# Altium schematic sheet GPS.SchDoc
size A4; SheetNumber: 2; SheetTotal: 5
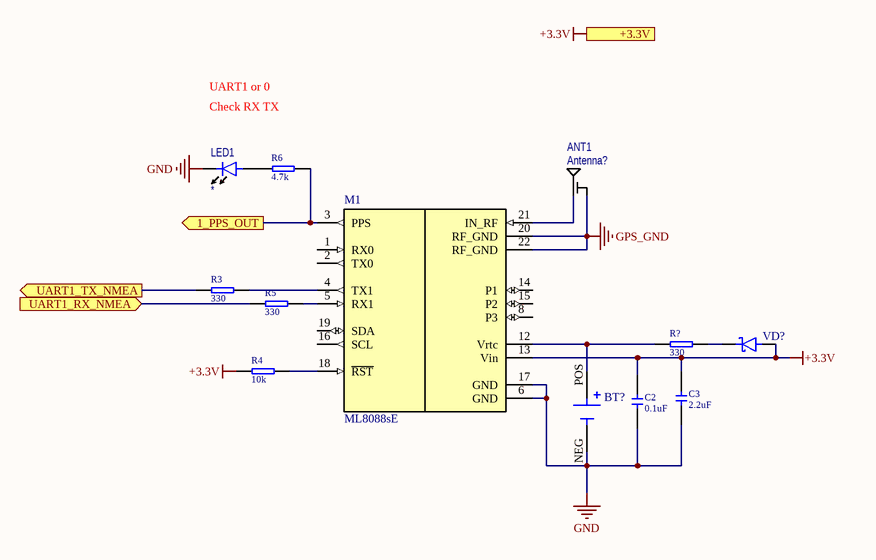
[diagram p0: GPS.SchDoc]

## Parts
ANT1  Antenna?  [IPEX-3P]
BT?  MS621FE-FL11E  [BAT_MS621FE-FL11E]  (value not drawn)
C2  value 0.1uF  [CERCAP 0402]
C3  value 2.2uF  [CERCAP 0603]
LED1  (no value)  [LED 0603]
M1  ML8088sE  [MODULE_ML8088S]
R3  value 330  [RES 0402]
R4  value 10k  [RES 0402]
R5  value 330  [RES 0402]
R6  value 4.7k  [RES 0402]
R?  value 330  [RES 0402]
VD?  (no value)  [SOD-123]

## Ports
1_PPS_OUT (out), +3.3V, UART1_RX_NMEA (in), UART1_TX_NMEA (out)

## Nets
+3.3V: C2.2 C3.2 M1.13(Vin) R4.1 VD?.A(Anode) ; port +3.3V
GND: BT?.NEG C2.1 C3.1 LED1.2(Cathode) M1.6(GND) M1.17(GND)
GPS_GND: ANT1.0 M1.20(RF_GND) M1.22(RF_GND)
1_PPS_OUT: M1.3(PPS) R6.2 ; port 1_PPS_OUT
UART1_RX_NMEA: R5.1 ; port UART1_RX_NMEA
UART1_TX_NMEA: R3.1 ; port UART1_TX_NMEA
NetANT1_1: ANT1.1 M1.21(IN_RF)
NetBT?_POS: BT?.POS M1.12(Vrtc) R?.1
NetLED1_1: LED1.1(Anode) R6.1
NetM1_4: M1.4(TX1) R3.2
NetM1_5: M1.5(RX1) R5.2
NetM1_18: M1.18(~{RST}) R4.2
NetR?_2: R?.2 VD?.C(Cathode)

Not connected (* = marked no-connect by the designer): M1 1(RX0) 2(TX0) 8(P3) 14(P1) 15(P2) 16(SCL) 19(SDA)

## Notes on the sheet
- UART1 or 0
- Check RX TX

## Library data of the parts
ANT1 = Antenna: HF con; IsSMT: NoSMT
BT? = MS621FE-FL11E: Coin, 6.8mm 3V Lithium Battery Rechargeable (Secondary) 5.5mAh; MF: Seiko Instruments; SnapEDA_Link: https://www.snapeda.com/parts/MS621FE-FL11E/Seiko%20Instruments/view-part/6886595/?ref=snap; MP: MS621FE-FL11E; Availability: In Stock; Price: None; Check_prices: https://www.snapeda.com/parts/MS621FE-FL11E/Seiko%20Instruments/view-part/6886595/?ref=eda; Value: *; Purchase-URL: https://pricing.snapeda.com/search/part/MS621FE-FL11E/?ref=eda; Package: QFP-128 Seiko
C2 C3 = !Capacitor: Capacitor; IsSMT: NoSMT; Diel: X7R; Voltage: *
LED1 = LED: Light Emittering Diode; IsSMT: NoSMT; Value: *
M1 = GNSS_NAVIA_ML8088sE: GNSS 50km; Order: ML8088sl
R3-R6 R? = !Resistor: Resistor; IsSMT: NoSMT
VD? = DiodeS: Diode Shottky; IsSMT: NoSMT